# EAGLE design SaltwatersEchoControls (EAGLE 9.6.2)
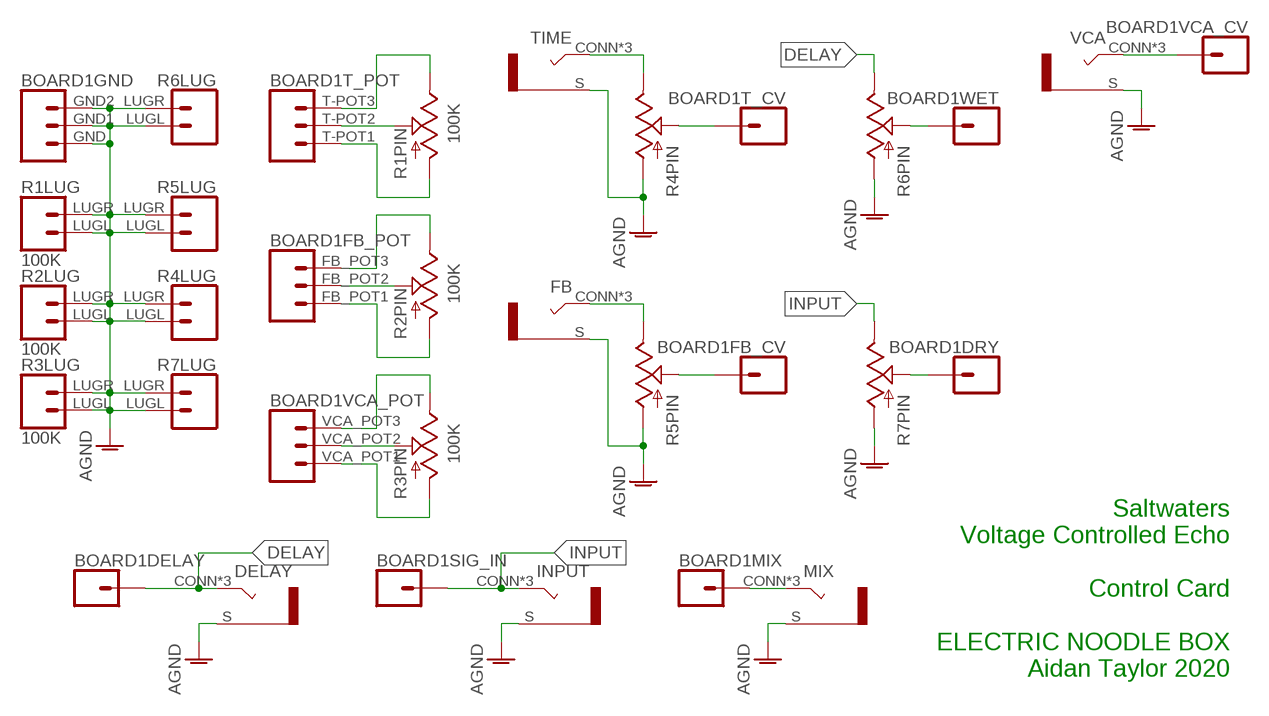
[diagram p0: schematic, sheet 1]

## Parts
BOARD1  SALTWATERS_LINK  [SALTWATERS]
DELAY  COMBI-JACKCINCHNANA  [NEWCOMBOJACK_PANEL]
FB  COMBI-JACKCINCHNANA  [NEWCOMBOJACK_PANEL]
INPUT  COMBI-JACKCINCHNANA  [NEWCOMBOJACK_PANEL]
MIX  COMBI-JACKCINCHNANA  [NEWCOMBOJACK_PANEL]
R1  100K  POTENTIOMETER  [ALPHA_RV09_9MMPOT]
R2  100K  POTENTIOMETER  [ALPHA_RV09_9MMPOT]
R3  100K  POTENTIOMETER  [ALPHA_RV09_9MMPOT]
R4  POTENTIOMETER  [ALPHA_RV09_9MMPOT]
R5  POTENTIOMETER  [ALPHA_RV09_9MMPOT]
R6  POTENTIOMETER  [ALPHA_RV09_9MMPOT]
R7  POTENTIOMETER  [ALPHA_RV09_9MMPOT]
TIME  COMBI-JACKCINCHNANA  [NEWCOMBOJACK_PANEL]
VCA  COMBI-JACKCINCHNANA  [NEWCOMBOJACK_PANEL]

## Nets
AGND: BOARD1.GND BOARD1.GND1 BOARD1.GND2 DELAY.S FB.S INPUT.S MIX.S R1.LUGL R1.LUGR R2.LUGL R2.LUGR R3.LUGL R3.LUGR R4.C1(PIN:A) R4.LUGL R4.LUGR R5.C1(PIN:A) R5.LUGL R5.LUGR R6.C1(PIN:A) R6.LUGL R6.LUGR R7.C1(PIN:A) R7.LUGL R7.LUGR TIME.S VCA.S
DELAY: BOARD1.DELAY DELAY.CONN(T) DELAY.T1(T) DELAY.T2(T) R6.C3(PIN:B)
INPUT: BOARD1.SIG_IN INPUT.CONN(T) INPUT.T1(T) INPUT.T2(T) R7.C3(PIN:B)
N$1: BOARD1.T-POT2 R1.C2(PIN:W)
N$2: BOARD1.T-POT3 R1.C3(PIN:B)
N$3: BOARD1.T-POT1 R1.C1(PIN:A)
N$4: BOARD1.FB_POT2 R2.C2(PIN:W)
N$5: BOARD1.FB_POT3 R2.C3(PIN:B)
N$6: BOARD1.FB_POT1 R2.C1(PIN:A)
N$7: BOARD1.VCA_POT2 R3.C2(PIN:W)
N$8: BOARD1.VCA_POT3 R3.C3(PIN:B)
N$9: BOARD1.VCA_POT1 R3.C1(PIN:A)
N$10: R4.C3(PIN:B) TIME.CONN(T) TIME.T1(T) TIME.T2(T)
N$11: FB.CONN(T) FB.T1(T) FB.T2(T) R5.C3(PIN:B)
N$12: BOARD1.T_CV R4.C2(PIN:W)
N$13: BOARD1.WET R6.C2(PIN:W)
N$14: BOARD1.FB_CV R5.C2(PIN:W)
N$15: BOARD1.DRY R7.C2(PIN:W)
N$16: BOARD1.MIX MIX.CONN(T) MIX.T1(T) MIX.T2(T)
N$17: BOARD1.VCA_CV VCA.CONN(T) VCA.T1(T) VCA.T2(T)

## Notes on the sheet
- Saltwaters
  Voltage Controlled Echo
  
  Control Card
  
  ELECTRIC NOODLE BOX
  Aidan Taylor 2020

## Library data of the parts
BOARD1 = ElectricNoodleBox:SALTWATERS_LINK
DELAY FB INPUT MIX TIME VCA = ElectricNoodleBox:COMBI-JACK
R1-R7 = ElectricNoodleBox:POTENTIOMETER

## Board
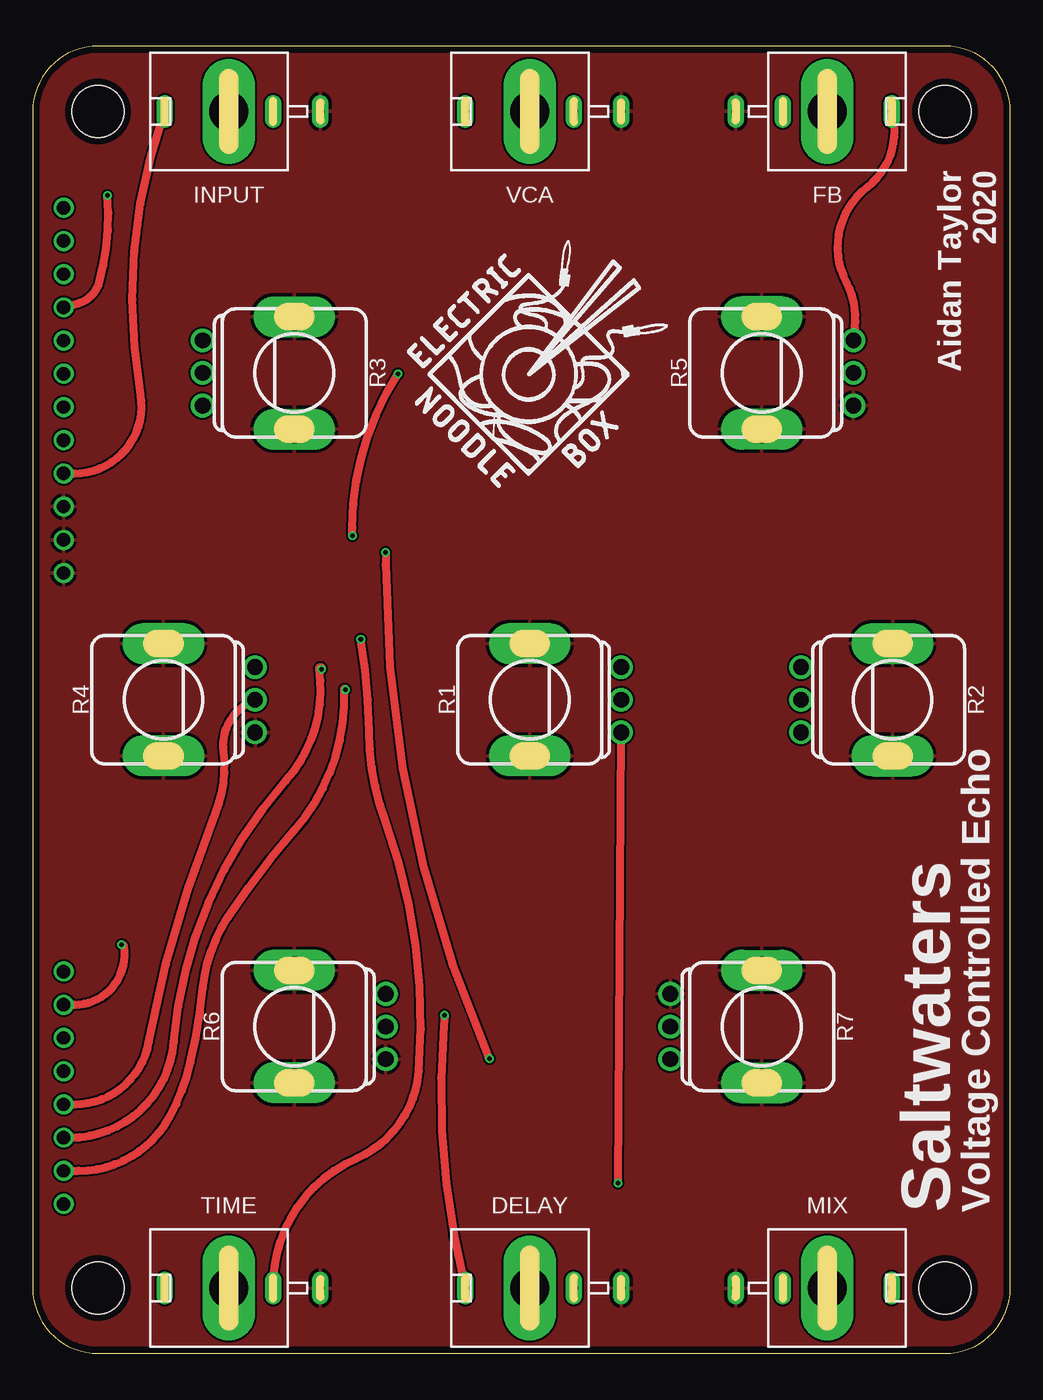
[diagram p1: board, top side]
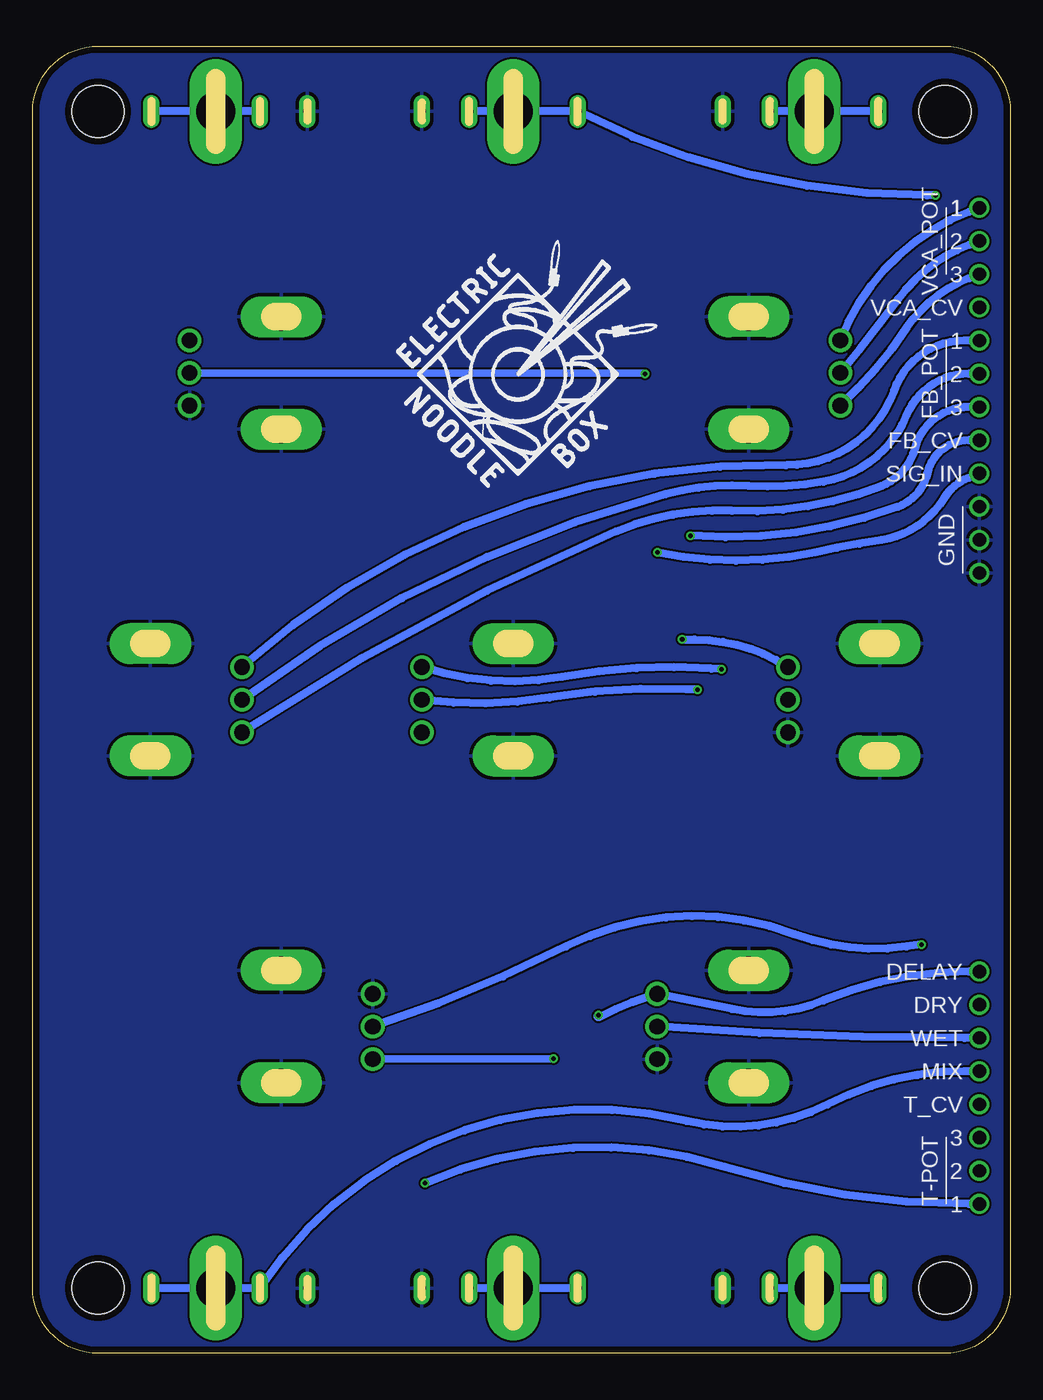
[diagram p2: board, bottom side, seen from below]

Size 74.75 x 100 mm. Coordinates in mm from the lower left corner, seen from the top.
Outline: 0,95 0,5 arc90 5,0 69.75,0 arc90 74.75,5 74.75,95 arc90 69.75,100 5,100 arc90 0,95
Copper layers (1*16): Top 0.035mm / dielectric 1.6mm / Bottom 0.035mm
Design rules "Elecrow_2-layer_PCB_eagle_rule": minimum track width 6mil, minimum drill 12mil, track to track 6mil, track to pad 6mil, pad to pad 6mil, via to via 8mil, smd to smd 0mil, copper to edge 20mil, drill to drill 10mil, minimum pad ring 6mil, minimum via ring 6mil, stop-mask expansion 0mil, vias tented up to drill 100mil, thermal gap 10mil

### Footprints (pad centres in the part's own frame; a part is rotated, then mirrored left to right if it is on the bottom)
SALTWATERS = drill 1.016: DELAY 72.39,29.21; DRY 72.39,26.67; FB_CV 72.39,69.85; FB_POT1 72.39,77.47; FB_POT2 72.39,74.93; FB_POT3 72.39,72.39; GND 72.39,59.69; GND1 72.39,62.23; GND2 72.39,64.77; MIX 72.39,21.59; SIG_IN 72.39,67.31; T-POT1 72.39,11.43; T-POT2 72.39,13.97; T-POT3 72.39,16.51; T_CV 72.39,19.05; VCA_CV 72.39,80.01; VCA_POT1 72.39,87.63; VCA_POT2 72.39,85.09; VCA_POT3 72.39,82.55; WET 72.39,24.13 | hole 4: 5,5; 69.75,5; 69.75,95; 5,95
NEWCOMBOJACK_PANEL = drill 3 pad 3.6 long: CONN 0,0 | drill 0.6 pad 1.27 long: S 0,-7; T1 0,4.92; T2 0,-3.38
ALPHA_RV09_9MMPOT = drill 1.2 pad 1.778: C1 -2.5,-7; C2 0,-7; C3 2.5,-7 | drill 2.1 pad 2.8 long: LUGL -4.3,0; LUGR 4.3,0

### Placement (x,y rotation side)
BOARD1  74.75,0 0 bottom
DELAY  38,5 90 top
FB  60.75,95 270 top
INPUT  15,95 90 top
MIX  60.75,5 270 top
R1  38,50 90 top
R2  65.75,50 270 top
R3  20,75 270 top
R4  10,50 90 top
R5  55.75,75 90 top
R6  20,25 90 top
R7  55.75,25 270 top
TIME  15,5 90 top
U$1  [LOGO20X20]  28.57,65.72 0 top
U$2  [LOGO20X20]  46.99,65.72 0 bottom
VCA  38,95 90 top

### Tracks (layer width: path | path; a pad name or v marks a point on that pad's centre or on a via)
AGND
  pour Top: 0,0 74.75,0 74.75,100 0,100
  pour Bottom: 0,0 74.75,0 74.75,100 0,100
DELAY  (via drill 0.35)
  Top 0.61: v31.5,25.88 31.43,25.08 arc19 DELAY.T1
  Bottom 0.61: BOARD1.DELAY 3.17,29.21 arc-23 14.29,26.99 arc35 21.27,26.35 arc-2 R6.C3 27.62,27.3 arc-10 31.43,25.72 arc190 v31.5,25.88 | DELAY.T1 DELAY.CONN DELAY.T2
INPUT  (via drill 0.35)
  Top 0.61: BOARD1.SIG_IN 3.17,67.31 arc100 8.26,73.34 arc-29 INPUT.T1 | v26.99,61.28 26.99,60.33 arc24 v34.92,22.54
  Bottom 0.61: BOARD1.SIG_IN 3.17,66.99 arc-37 5.08,65.41 arc49 9.84,62.23 arc-3 14.92,61.28 arc24 v26.99,61.28 | v34.92,22.54 R7.C3 | INPUT.T1 INPUT.CONN INPUT.T2
N$1  (via drill 0.35)
  Top 0.61: BOARD1.T-POT2 3.49,13.97 arc61 10.48,18.1 arc16 12.06,22.23 arc8 13.02,27.94 arc-27 14.92,33.34 arc-8 20,40.01 arc44 23.81,50.8 arc-224 v23.91,50.77
  Bottom 0.61: v23.91,50.77 24.77,50.8 arc-12 35.24,50.16 arc17 R1.C2
N$2  (via drill 0.35)
  Top 0.61: BOARD1.T-POT3 2.86,16.51 arc85 10.79,23.81 arc-37 19.37,43.81 arc50 21.91,52.39 arc-230 v22.08,52.34
  Bottom 0.61: v22.08,52.34 22.86,52.39 arc-14 34.29,51.75 arc28 R1.C3
N$3  (via drill 0.35)
  Top 0.61: v44.77,13.02 R1.C1
  Bottom 0.61: BOARD1.T-POT1 3.17,11.43 arc17 21.91,14.29 arc-41 v44.77,13.02
N$4
  Bottom 0.61: BOARD1.FB_POT2 3.17,74.93 arc-67 7.94,71.75 arc57 14.29,66.67 arc14 20,66.36 arc-19 26.35,65.72 arc-22 R2.C2
N$5
  Bottom 0.61: BOARD1.FB_POT3 3.17,72.39 arc-75 7.3,69.22 arc54 9.84,66.36 arc24 21.27,64.45 arc-26 30.16,62.87 arc-11 R2.C3
N$6
  Bottom 0.61: BOARD1.FB_POT1 3.49,77.47 arc-70 8.89,73.66 arc71 17.14,67.94 arc-43 R2.C1
N$7
  Bottom 0.61: BOARD1.VCA_POT2 3.17,84.77 arc-32 8.57,80.64 arc3 R3.C2
N$8
  Bottom 0.61: BOARD1.VCA_POT3 3.17,82.23 arc-35 7.94,78.42 arc13 R3.C3
N$9
  Bottom 0.61: BOARD1.VCA_POT1 3.17,87.31 arc-47 R3.C1
N$10  (via drill 0.35)
  Top 0.61: TIME.T2 18.41,5.71 arc-64 24.77,14.92 arc62 29.53,21.59 arc25 26.99,40.64 arc-19 25.72,47.62 arc9 v25.08,54.61
  Bottom 0.61: v25.08,54.61 24.13,54.61 arc33 R4.C3 | TIME.T1 TIME.CONN TIME.T2
N$11
  Top 0.61: R5.C3 62.87,78.42 arc35 62.23,81.92 arc-80 63.82,89.22 arc69 FB.T1
  Bottom 0.61: FB.T2 FB.CONN FB.T1
N$12
  Top 0.61: BOARD1.T_CV 3.17,19.05 arc80 8.89,23.81 arc-12 13.97,41.27 arc29 14.61,46.04 arc-76 R4.C2
N$13
  Bottom 0.61: BOARD1.WET 3.49,24.13 arc4 R6.C2
N$14  (via drill 0.35)
  Top 0.61: v24.45,62.55 24.45,63.18 arc-33 v27.94,74.93
  Bottom 0.61: BOARD1.FB_CV 3.17,69.85 arc-77 6.35,67.31 arc57 8.57,64.77 arc25 v24.45,62.55 | v27.94,74.93 R5.C2
N$15  (via drill 0.35)
  Top 0.61: BOARD1.DRY 3.17,26.67 arc99 6.99,31.11 arc81 v6.8,31.27
  Bottom 0.61: v6.8,31.27 7.94,31.11 arc28 16.51,32.07 arc-47 33.97,31.11 arc9 R7.C2
N$16
  Bottom 0.61: BOARD1.MIX 3.49,21.59 arc-27 13.97,19.05 arc41 24.77,17.78 arc-70 MIX.T2 MIX.CONN MIX.T1
N$17  (via drill 0.35)
  Top 0.61: BOARD1.VCA_CV 3.49,80.33 arc59 5.08,81.92 arc20 v5.71,88.58
  Bottom 0.61: v5.71,88.58 6.35,88.58 arc27 VCA.T1 VCA.CONN VCA.T2

### Text on the board
tPlace: Aidan Taylor / 2020 | Saltwaters | Voltage Controlled Echo